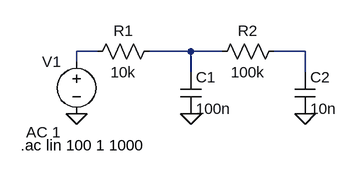
[diagram p0: schematic 2nd_order_RC_filter.asc]
2nd_order_RC_filter.asc, the LTspice schematic file:
Version 4
SHEET 1 880 680
WIRE 32 128 0 128
WIRE 176 128 112 128
WIRE 224 128 176 128
WIRE 352 128 304 128
WIRE 0 144 0 128
WIRE 176 160 176 128
WIRE 352 160 352 128
FLAG 0 224 0
FLAG 176 224 0
FLAG 352 224 0
SYMBOL res 128 112 R90
WINDOW 0 0 56 VBottom 2
WINDOW 3 32 56 VTop 2
SYMATTR InstName R1
SYMATTR Value 10k
SYMBOL res 320 112 R90
WINDOW 0 0 56 VBottom 2
WINDOW 3 32 56 VTop 2
SYMATTR InstName R2
SYMATTR Value 100k
SYMBOL cap 160 160 R0
SYMATTR InstName C1
SYMATTR Value 100n
SYMBOL cap 336 160 R0
SYMATTR InstName C2
SYMATTR Value 10n
SYMBOL voltage 0 128 M0
WINDOW 123 24 124 Left 2
WINDOW 39 0 0 Left 2
SYMATTR InstName V1
SYMATTR Value ""
SYMATTR Value2 AC 1
TEXT -86 272 Left 2 !.ac lin 100 1 1000

The netlist it stands for:
* 2nd_order_RC_filter.asc
R1 N002 N001 10k
R2 N003 N002 100k
C1 N002 0 100n
C2 N003 0 10n
V1 N001 0 AC 1
.ac lin 100 1 1000
.backanno
.end